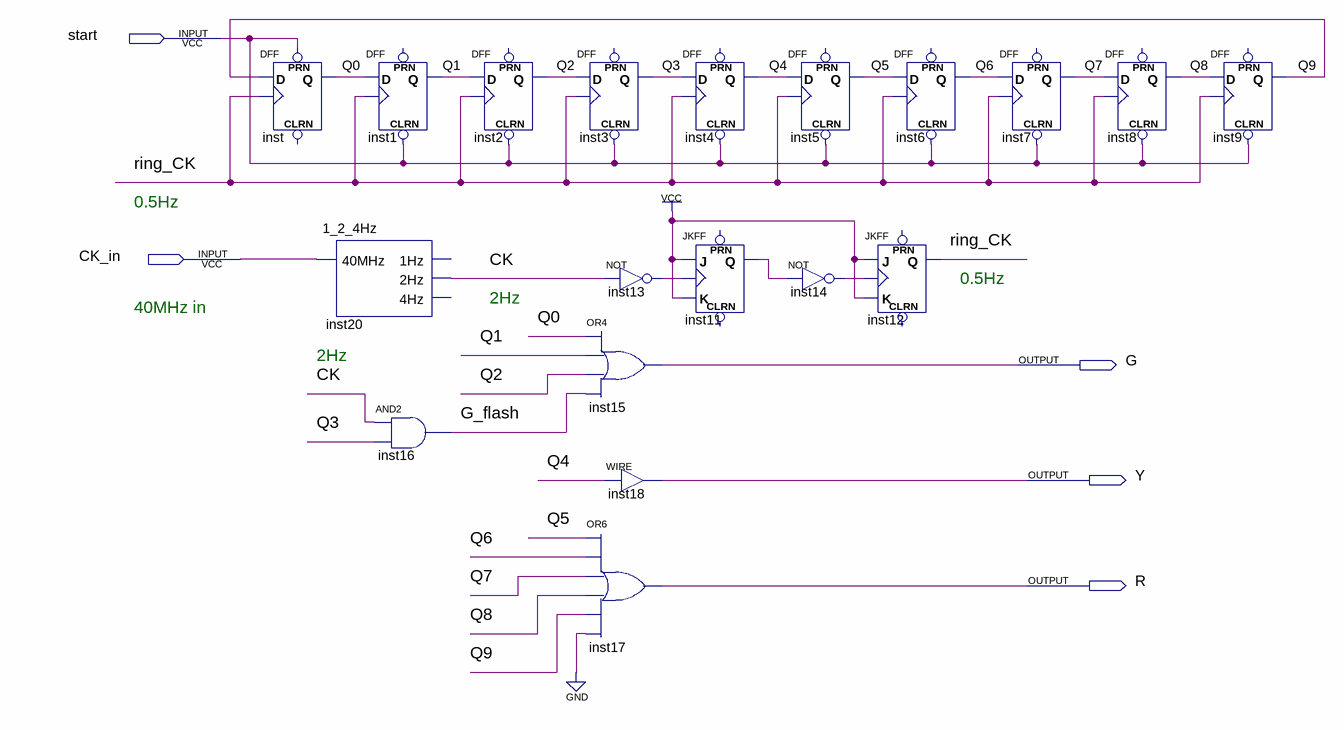
[diagram p0: schematic sheet]
// Quartus schematic Traffic_lights_test.bdf as structural Verilog: 19 symbols, 5 pins
module Traffic_lights_test (
  input  start,
  input  CK_in,
  output G,
  output Y,
  output R
);

  wire CK, G_flash, inst11_q, inst13_out, inst14_out, Q0, Q1, Q2, Q3, Q4, Q5, Q6, Q7, Q8, Q9, ring_CK;

  DFF inst (.CLK(ring_CK), .D(Q9), .PRN(start), .Q(Q0));  // open: CLRN
  DFF inst1 (.CLRN(start), .CLK(ring_CK), .D(Q0), .Q(Q1));  // open: PRN
  \1_2_4Hz  inst20 (.\40MHz (CK_in), .\2Hz (CK));  // open: 1Hz, 4Hz
  and inst16 (G_flash, CK, Q3);
  DFF inst2 (.CLRN(start), .CLK(ring_CK), .D(Q1), .Q(Q2));  // open: PRN
  DFF inst3 (.CLRN(start), .CLK(ring_CK), .D(Q2), .Q(Q3));  // open: PRN
  or inst15 (G, Q0, Q1, Q2, G_flash);
  or inst17 (R, Q5, Q6, Q7, Q8, Q9, 1'b0);
  not inst13 (inst13_out, CK);
  assign Y = Q4;  // WIRE inst18
  DFF inst4 (.CLRN(start), .CLK(ring_CK), .D(Q3), .Q(Q4));  // open: PRN
  JKFF inst11 (.K(1'b1), .J(1'b1), .CLK(inst13_out), .Q(inst11_q));  // open: PRN, CLRN
  DFF inst5 (.CLRN(start), .CLK(ring_CK), .D(Q4), .Q(Q5));  // open: PRN
  not inst14 (inst14_out, inst11_q);
  DFF inst6 (.CLRN(start), .CLK(ring_CK), .D(Q5), .Q(Q6));  // open: PRN
  JKFF inst12 (.K(1'b1), .J(1'b1), .CLK(inst14_out), .Q(ring_CK));  // open: PRN, CLRN
  DFF inst7 (.CLRN(start), .CLK(ring_CK), .D(Q6), .Q(Q7));  // open: PRN
  DFF inst8 (.CLRN(start), .CLK(ring_CK), .D(Q7), .Q(Q8));  // open: PRN
  DFF inst9 (.CLRN(start), .CLK(ring_CK), .D(Q8), .Q(Q9));  // open: PRN

  // Notes on the sheet:
  //   0.5Hz
  //   0.5Hz
  //   2Hz
  //   40MHz in
  //   2Hz
endmodule
